# EAGLE design hazard (EAGLE 9.5.2)
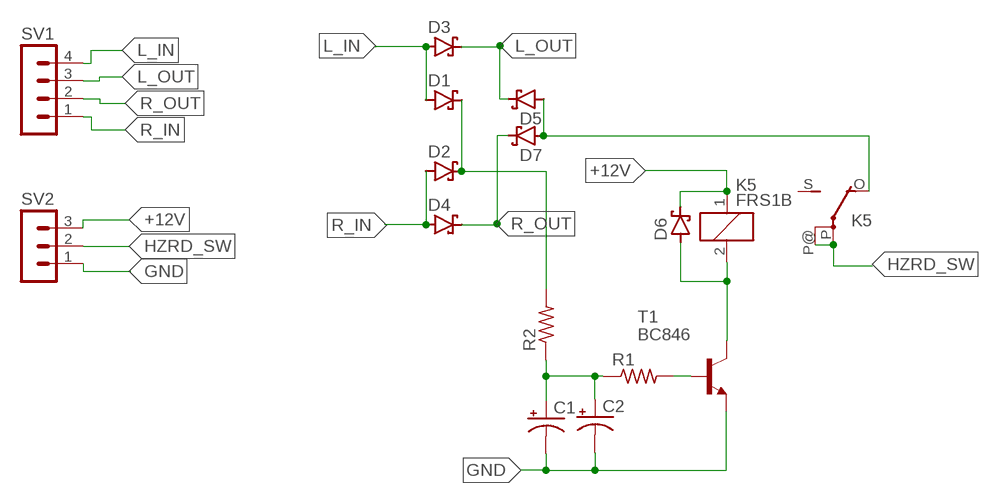
[diagram p0: schematic, sheet 1]

## Parts
C1  CPOL-USE1.8-4  [E1,8-4]
C2  CPOL-USE1.8-4  [E1,8-4]
D1  SCHOTTKY-DIODESMD  [SMB]
D2  SCHOTTKY-DIODESMD  [SMB]
D3  SCHOTTKY-DIODESMD  [SMB]
D4  SCHOTTKY-DIODESMD  [SMB]
D5  SCHOTTKY-DIODESMD  [SMB]
D6  SCHOTTKY-DIODESMD  [SMB]
D7  SCHOTTKY-DIODESMD  [SMB]
K5  FRS1B  [FRS1B]
R1  R-US_R0603  [R0603]
R2  R-US_R0603  [R0603]
SV1  MA04-1  [MA04-1]
SV2  MA03-1  [MA03-1]
T1  BC846  [SOT23]

## Nets
+12V: D6.C K5.1 SV2.3
GND: C1.- C2.- SV2.1 T1.2(E)
HZRD_SW: K5.P(2:P) K5.P@(2:P) SV2.2
L_IN: D1.A D3.A SV1.4
L_OUT: D3.C D5.C SV1.3
N$1: D5.A D7.A K5.O(2:O)
N$2: D6.A K5.2 T1.3(C)
N$3: R1.2 T1.1(B)
N$4: C1.+ C2.+ R1.1 R2.1
N$6: D1.C D2.C R2.2
R_IN: D2.A D4.A SV1.1
R_OUT: D4.C D7.C SV1.2
Unconnected: K5.S(2:S)

## Library data of the parts
C1 C2 = rcl:CPOL-US: POLARIZED CAPACITOR, American symbol; SPICEPREFIX: C
D1-D7 = diode:SCHOTTKY-DIODE: Schottky Diode
K5 = relay:FRS1B: RELAY 1 x switch, same as V23101-D6-A201, Siemens; OC_FARNELL: unknown; OC_NEWARK: unknown
R1 R2 = rcl:R-US_: RESISTOR, American symbol; SPICEPREFIX: R
SV1 = con-lstb:MA04-1: PIN HEADER; OC_FARNELL: unknown; OC_NEWARK: unknown
SV2 = con-lstb:MA03-1: PIN HEADER; OC_FARNELL: unknown; OC_NEWARK: unknown
T1 = transistor:BC846: NPN TRANSISTOR

## Board
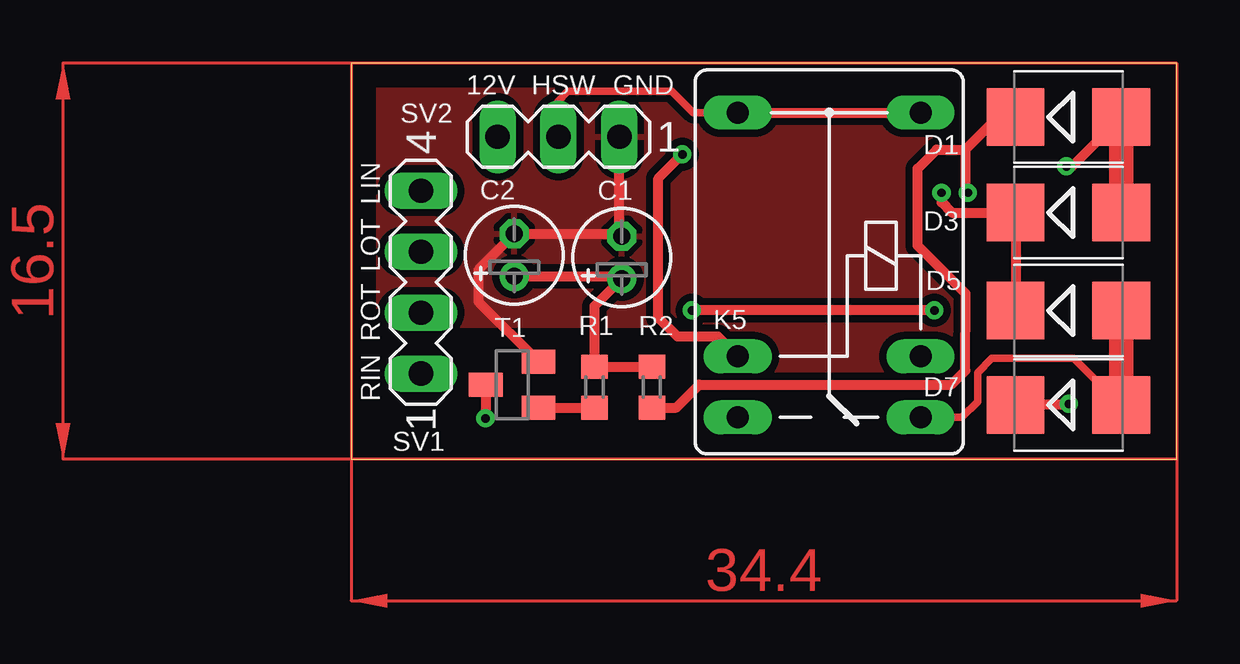
[diagram p1: board, top side]
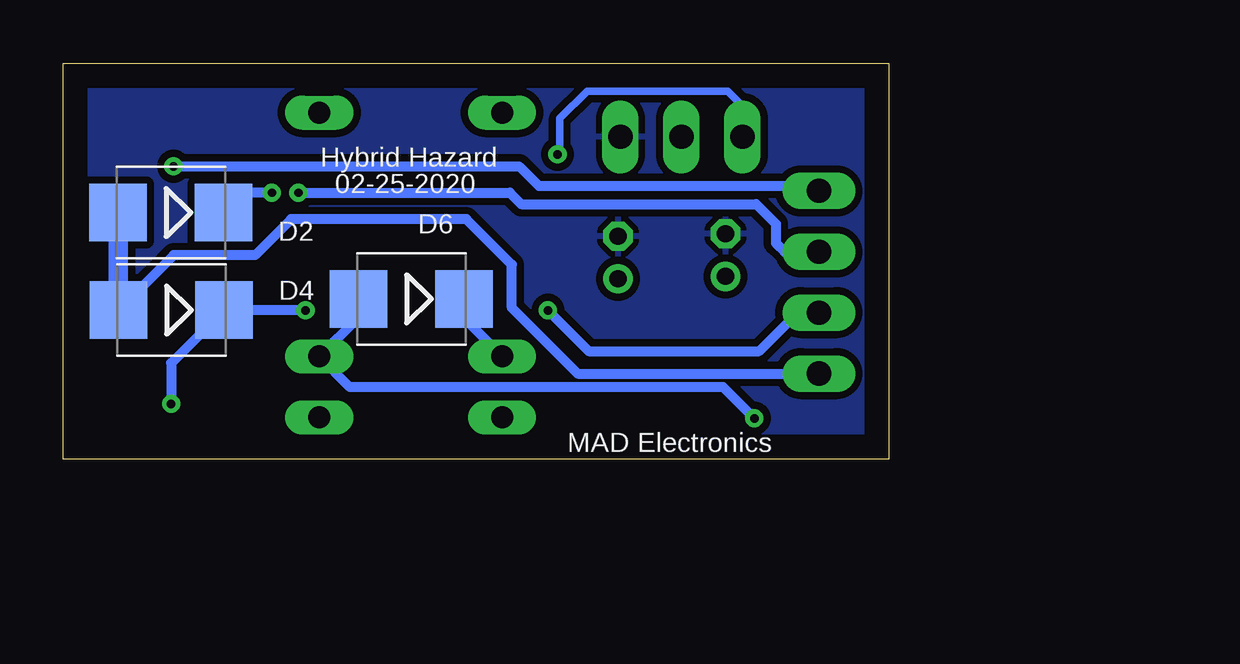
[diagram p2: board, bottom side, seen from below]

Size 34.4 x 16.5 mm. Coordinates in mm from the lower left corner, seen from the top.
Outline: 0,0 34.4,0 34.4,16.5 0,16.5 0,0
Copper layers (1*16): Top 0.035mm / dielectric 1.5mm / Bottom 0.035mm
Design rules "default": minimum track width 6mil, minimum drill 0.35mm, track to track 6mil, track to pad 6mil, pad to pad 6mil, via to via 6mil, smd to smd 6mil, copper to edge 40mil, drill to drill 6mil, minimum pad ring 10mil, minimum via ring 8mil, stop-mask expansion 4mil, vias tented up to drill 0mil, thermal gap 10mil

### Footprints (pad centres in the part's own frame; a part is rotated, then mirrored left to right if it is on the bottom)
E1,8-4 = drill 0.711 pad 1.168: + -0.889,0 | drill 0.711 pad 1.168 octagon: - 0.889,0
SMB = smd 2.4 x 2.4: A 2.2,0; C -2.2,0
FRS1B = drill 0.914 long: 1 0,3.81; 2 0,-3.81; O -2.54,-3.81; P 10.16,3.81; P@ 10.16,-3.81; S -2.54,3.81
R0603 = smd 1 x 1.1: 1 -0.85,0; 2 0.85,0
MA04-1 = drill 1.016 long: 1 -3.81,0; 2 -1.27,0; 3 1.27,0; 4 3.81,0
MA03-1 = drill 1.016 long: 1 -2.54,0; 2 0,0; 3 2.54,0
SOT23 = smd 1 x 1.4: 1 -0.95,-1.1; 2 0.95,-1.1; 3 0,1.1

### Placement (x,y rotation side)
C1  11.28,8.4 90 top
C2  6.8,8.5 90 top
D1  29.89,14.25 0 top
D2  29.91,10.27 180 bottom
D3  29.89,10.27 0 top
D4  29.89,6.21 180 bottom
D5  29.89,6.19 0 top
D6  19.89,6.68 180 bottom
D7  29.89,2.26 0 top
K5  19.92,4.28 90 top
R1  10.14,3 270 top
R2  12.53,3 270 top
SV1  2.91,7.37 90 top
SV2  8.64,13.43 180 top
T1  6.71,3.1 90 top

### Tracks (layer width: path | path; a pad name or v marks a point on that pad's centre or on a via)
+12V  (via drill 0.35)
  Top 0.406: K5.1 15.29,5.1 13.6,5.1 12.8,5.9 12.8,11.7 v13.8,12.7
  Bottom 0.305: v13.8,12.7 13.7,12.8 13.7,14.2 12.57,15.33 6.7,15.33 6.1,14.73 SV2.3
  Bottom 0.406: K5.1 17.69,5.86 D6.C
GND
  Top 0.406: 11.18,9.39 C2.- 5.3,7.89 5.3,6.56 T1.2 | C1.- 11.18,9.39 | 11.18,9.39 SV2.1
  pour Bottom (isolate 0.305): 0.1,16.4 34.3,16.4 34.3,0.1 0.1,0.1
  pour Top (isolate 0.305): 0.2,16.3 34.2,16.3 34.2,0.2 14.6,0.2 14.6,5.5 0.3,5.5 0.2,5.4
HZRD_SW
  Top 0.305: K5.P 14.26,14.44 13.37,15.33 9.03,15.33 8.6,14.9 8.6,13.47 SV2.2
  Top 0.406: K5.P K5.P@
L_IN  (via drill 0.35)
  Top 0.406: D1.A 30.04,12.2 v29.8,12.2
  Top 1.016: D1.A D3.A
  Bottom 0.406: v29.8,12.2 15.4,12.2 14.58,11.38 3.11,11.38 SV1.4
L_OUT  (via drill 0.35)
  Top 0.406: v24.6,11.1 24.6,10.7 25.03,10.27 D3.C D5.C
  Bottom 0.406: v24.6,11.1 15.79,11.1 15.31,10.62 5.52,10.62 4.7,9.8 4.7,9 4.34,8.64 SV1.3
N$1
  Top 0.305: D7.A 32.04,2.26 30.1,4.2 26.7,4.2 26.1,3.6 26.1,2.4 25.44,1.74 K5.O
  Top 1.016: D5.A D7.A
N$2  (via drill 0.35)
  Top 0.406: T1.3 v5.61,1.71 v5.6,1.7
  Bottom 0.406: D6.A 22.09,5.92 K5.2 22.45,3 6.9,3 v5.6,1.7
N$3
  Top 0.406: T1.1 R1.2
N$4
  Top 0.406: R2.1 R1.1 10.14,6.37 C1.+ 11.18,7.61 C2.+
N$6  (via drill 0.35)
  Top 0.406: R2.2 13.55,2.15 14.5,3.1 25,3.1 25.59,3.69 25.6,6.9 23.6,8.9 23.6,12.1 24.39,12.89 25.59,12.89 | 25.59,12.89 26.95,14.25 D1.C | 25.59,12.89 25.59,11.21 v25.7,11.1
  Bottom 0.406: v25.7,11.1 26.88,11.1 D2.C
  Bottom 1.016: D2.C
R_IN
  Bottom 0.406: D4.A 29.8,8.5 26.4,8.5 24.9,10 17.6,10 15.7,8.1 15.7,6.3 12.96,3.56 SV1.1
  Bottom 0.813: D2.A 32.11,6.23 D4.A
R_OUT  (via drill 0.35)
  Top 0.406: v29.9,2.3 29.86,2.26 D7.C | v24.3,6.2 v14.2,6.2
  Bottom 0.406: v14.2,6.2 12.5,4.5 5.4,4.5 3.9,6 3.9,6.1 SV1.2 | v29.9,2.3 29.9,4 D4.C v24.3,6.2
(copper drawn outside any net)
  shapes: Top area x2

### Text on the board
tNames: 12V | HSW | GND | LIN | LOT | ROT | RIN
bNames: Hybrid Hazard | 02-25-2020 | MAD Electronics